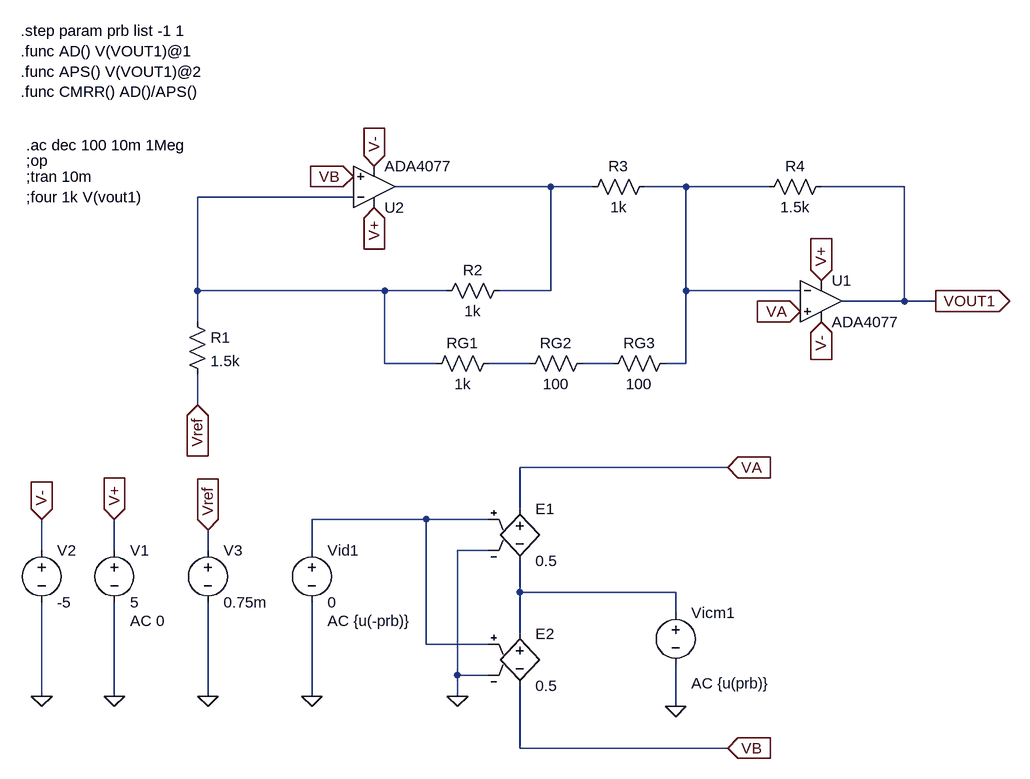
[diagram p0: schematic Etaj1CMRR.asc]
Etaj1CMRR.asc, the LTspice schematic file:
Version 4
SHEET 1 892 760
WIRE 160 -176 -80 -176
WIRE 224 -176 160 -176
WIRE 368 -176 304 -176
WIRE 496 -176 368 -176
WIRE 704 -176 576 -176
WIRE -144 -160 -384 -160
WIRE -384 -16 -384 -160
WIRE -96 -16 -384 -16
WIRE 0 -16 -96 -16
WIRE 160 -16 160 -176
WIRE 160 -16 80 -16
WIRE 368 -16 368 -176
WIRE 544 -16 368 -16
WIRE 704 0 704 -176
WIRE 704 0 608 0
WIRE 752 0 704 0
WIRE -384 32 -384 -16
WIRE -96 96 -96 -16
WIRE -16 96 -96 96
WIRE 128 96 64 96
WIRE 256 96 208 96
WIRE 368 96 368 -16
WIRE 368 96 336 96
WIRE -384 160 -384 112
WIRE 432 256 112 256
WIRE 112 320 112 256
WIRE -32 336 -208 336
WIRE 64 336 -32 336
WIRE -624 384 -624 336
WIRE -512 384 -512 336
WIRE -368 384 -368 352
WIRE -208 384 -208 336
WIRE 64 384 16 384
WIRE 112 448 112 400
WIRE 352 448 112 448
WIRE 352 480 352 448
WIRE 112 512 112 448
WIRE -32 528 -32 336
WIRE 64 528 -32 528
WIRE 16 576 16 384
WIRE 64 576 16 576
WIRE -624 608 -624 464
WIRE -512 608 -512 464
WIRE -368 608 -368 464
WIRE -208 608 -208 464
WIRE 16 608 16 576
WIRE 352 624 352 560
WIRE 112 688 112 592
WIRE 432 688 112 688
FLAG -512 608 0
FLAG -624 608 0
FLAG -512 336 V+
IOPIN -512 336 In
FLAG -624 336 V-
IOPIN -624 336 In
FLAG 576 32 V-
IOPIN 576 32 In
FLAG -112 -208 V-
IOPIN -112 -208 In
FLAG 576 -32 V+
IOPIN 576 -32 In
FLAG -112 -144 V+
IOPIN -112 -144 In
FLAG 544 16 VA
IOPIN 544 16 In
FLAG -144 -192 VB
IOPIN -144 -192 In
FLAG 752 0 VOUT1
IOPIN 752 0 Out
FLAG -208 608 0
FLAG 16 608 0
FLAG 352 624 0
FLAG 432 256 VA
IOPIN 432 256 In
FLAG 432 688 VB
IOPIN 432 688 In
FLAG -368 352 Vref
IOPIN -368 352 In
FLAG -384 160 Vref
IOPIN -384 160 In
FLAG -368 608 0
SYMBOL res -400 16 R0
SYMATTR InstName R1
SYMATTR Value 1.5k
SYMBOL res 96 -32 R90
WINDOW 0 0 56 VBottom 2
WINDOW 3 32 56 VTop 2
SYMATTR InstName R2
SYMATTR Value 1k
SYMBOL res 320 -192 R90
WINDOW 0 0 56 VBottom 2
WINDOW 3 32 56 VTop 2
SYMATTR InstName R3
SYMATTR Value 1k
SYMBOL res 592 -192 R90
WINDOW 0 0 56 VBottom 2
WINDOW 3 32 56 VTop 2
SYMATTR InstName R4
SYMATTR Value 1.5k
SYMBOL res 80 80 R90
WINDOW 0 0 56 VBottom 2
WINDOW 3 32 56 VTop 2
SYMATTR InstName RG1
SYMATTR Value 1k
SYMBOL voltage -512 368 R0
WINDOW 123 24 124 Left 2
WINDOW 39 0 0 Left 0
SYMATTR Value2 AC 0
SYMATTR InstName V1
SYMATTR Value 5
SYMBOL voltage -624 368 R0
WINDOW 123 24 124 Left 2
WINDOW 39 0 0 Left 0
SYMATTR InstName V2
SYMATTR Value -5
SYMBOL e 112 304 R0
SYMATTR InstName E1
SYMATTR Value 0.5
SYMBOL e 112 496 R0
SYMATTR InstName E2
SYMATTR Value 0.5
SYMBOL voltage 352 464 R0
WINDOW 123 24 124 Left 2
WINDOW 39 0 0 Left 0
SYMATTR Value2 AC {u(prb)}
SYMATTR InstName Vicm1
SYMATTR Value ""
SYMBOL voltage -208 368 R0
WINDOW 123 24 124 Left 2
WINDOW 39 0 0 Left 0
SYMATTR Value2 AC {u(-prb)}
SYMATTR InstName Vid1
SYMATTR Value 0
SYMBOL voltage -368 368 R0
WINDOW 123 0 0 Left 0
WINDOW 39 0 0 Left 0
SYMATTR InstName V3
SYMATTR Value 0.75m
SYMBOL res 224 80 R90
WINDOW 0 0 56 VBottom 2
WINDOW 3 32 56 VTop 2
SYMATTR InstName RG2
SYMATTR Value 100
SYMBOL res 352 80 R90
WINDOW 0 0 56 VBottom 2
WINDOW 3 32 56 VTop 2
SYMATTR InstName RG3
SYMATTR Value 100
SYMBOL OpAmps\\ADA4077 576 -64 R0
SYMATTR InstName U1
SYMBOL OpAmps\\ADA4077 -112 -112 M180
SYMATTR InstName U2
TEXT -648 -216 Left 2 !;op
TEXT -648 -240 Left 2 !.ac dec 100 10m 1Meg
TEXT -656 -416 Left 2 !.step param prb list -1 1\n.func AD() V(VOUT1)@1\n.func APS() V(VOUT1)@2\n.func CMRR() AD()/APS()
TEXT -648 -192 Left 2 !;tran 10m
TEXT -648 -160 Left 2 !;four 1k V(vout1)

The netlist it stands for:
* Etaj1CMRR.asc
R1 N003 Vref 1.5k
R2 N001 N003 1k
R3 N002 N001 1k
R4 VOUT1 N002 1.5k
RG1 N004 N003 1k
V1 V+ 0 5 AC 0
V2 V- 0 -5
E1 VA N007 N006 0 0.5
E2 N007 VB N006 0 0.5
Vicm1 N007 0 AC {u(prb)}
Vid1 N006 0 0 AC {u(-prb)}
V3 Vref 0 0.75m
RG2 N005 N004 100
RG3 N002 N005 100
XU1 VA N002 V+ V- VOUT1 ADA4077  ; pins In+ In- V+ V- OUT
XU2 VB N003 V+ V- N001 ADA4077  ; pins In+ In- V+ V- OUT
;op
.ac dec 100 10m 1Meg
.step param prb list -1 1
.func AD() V(VOUT1)@1
.func APS() V(VOUT1)@2
.func CMRR() AD()/APS()
;tran 10m
;four 1k V(vout1)
.backanno
.end